# Altium schematic sheet Accelerometer.SchDoc
size A4
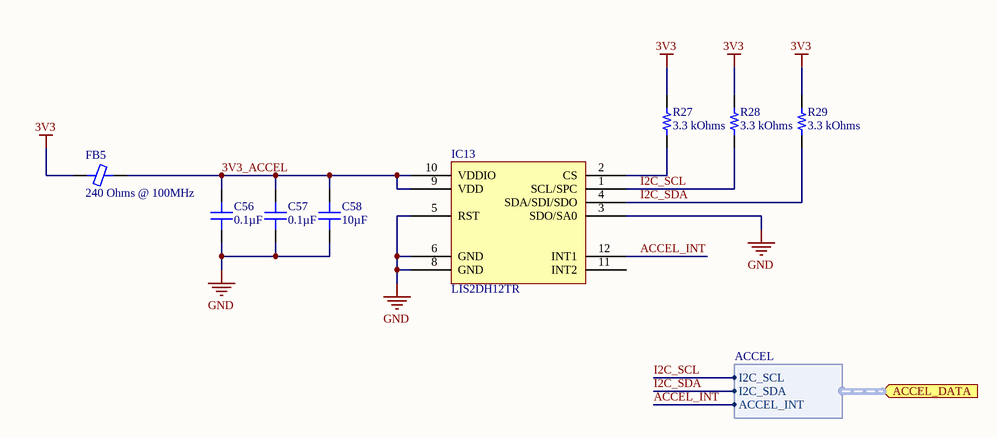
[diagram p0: Accelerometer.SchDoc]

## Parts
C56  0.1µF  [CAP 0201_0603]
C57  0.1µF  [CAP 0201_0603]
C58  10µF  [CAP 0603_1608]
FB5  240 Ohms @ 100MHz  [FER 0201_0603]
IC13  LIS2DH12TR  [ST LGA-12 2x2MM]
R27  3.3 kOhms  [RES 0201_0603]
R28  3.3 kOhms  [RES 0201_0603]
R29  3.3 kOhms  [RES 0201_0603]

## Ports
ACCEL_DATA (in, harness ACCEL)

## Harnesses
ACCEL: I2C_SCL, I2C_SDA, ACCEL_INT

## Nets
3V3: FB5.1 R27.2 R28.2 R29.2
GND: C56.1 C57.1 C58.1 IC13.3(SDO/SA0) IC13.5(RST) IC13.6(GND) IC13.8(GND)
3V3_ACCEL: C56.2 C57.2 C58.2 FB5.2 IC13.9(VDD) IC13.10(VDDIO)
ACCEL_INT: IC13.12(INT1) ; port ACCEL_DATA.ACCEL_INT
I2C_SCL: IC13.1(SCL/SPC) R28.1 ; port ACCEL_DATA.I2C_SCL
I2C_SDA: IC13.4(SDA/SDI/SDO) R29.1 ; port ACCEL_DATA.I2C_SDA
NetIC13_2: IC13.2(CS) R27.1

Not connected (* = marked no-connect by the designer): IC13 11(INT2)

## Notes on the sheet
- Title
- Size:
- Date:
- A4
- Number:
- Time:
- Revision:
- Sheet
- of
- File:

## Library data of the parts
C56 C57 = GRM033R61C104ME84D: CAP CER 0.1UF 16V X5R 0201; Manufacturer: Murata Electronics; Tolerance: ±20%; Part Number: GRM033R61C104ME84D; Value: 0.1µF; Applications: General Purpose; Capacitance: 0.1µF; ComponentLink1Description: Datasheet; ComponentLink1URL: https://search.murata.co.jp/Ceramy/image/img/A01X/G101/ENG/GRM033R61C104ME84-01.pdf; ComponentLink2Description: DigiKey Link; ComponentLink2URL: http://digikey.com/product-detail/en/murata-electronics/GRM033R61C104ME84D/490-9986-1-ND/5026291; Device Package: 0201 (0603 Metric); LastUpdated: 21/01/2020 00:00:12; Lifecycle Status: Active; Minimum Order: 1; Mounting Type: Surface Mount, MLCC; Operating Temperature: -55°C ~ 85°C; Package / Case: 0201 (0603 Metric); Packaging: TapeAndReel; PartId: 1522; Part Status: Active; Price: 0.01; Series: GRM; Size / Dimension: 0.024" L x 0.012" W (0.60mm x 0.30mm); Supplier 1: DigiKey; Supplier Part Number 1: 490-9986-1-ND; Temperature Coefficient: X5R; Thickness (Max): 0.013" (0.33mm); Voltage - Rated: 16V
C58 = LMK107BBJ106KALT: CAP CER 10UF 10V X5R 0603; Manufacturer: Taiyo Yuden; Tolerance: ±10%; Part Number: LMK107BBJ106KALT; Value: 10µF; Applications: SMPS Filtering; Capacitance: 10µF; ComponentLink1Description: Datasheet; ComponentLink1URL: https://ds.yuden.co.jp/TYCOMPAS/ut/detail?pn=LMK107BBJ106KALT &u=M; ComponentLink2Description: DigiKey Link; ComponentLink2URL: http://digikey.com/product-detail/en/taiyo-yuden/LMK107BBJ106KALT/587-6017-1-ND/8040680; Device Package: 0603 (1608 Metric); LastUpdated: 21/01/2020 00:01:56; Lifecycle Status: Active; Minimum Order: 1; Mounting Type: Surface Mount, MLCC; Operating Temperature: -55°C ~ 85°C; Package / Case: 0603 (1608 Metric); Packaging: TapeAndReel; PartId: 10454; Part Status: Active; Price: 0.03; Series: M; Size / Dimension: 0.063" L x 0.031" W (1.60mm x 0.80mm); Supplier 1: DigiKey; Supplier Part Number 1: 587-6017-1-ND; Temperature Coefficient: X5R; Thickness (Max): 0.039" (1.00mm); Voltage - Rated: 10V
FB5 = BK0603TS241-T: FERRITE BEAD 240 OHM 0201 1LN; Manufacturer: Taiyo Yuden; Current Rating (Max): 400mA; DC Resistance (DCR) (Max): 320mOhm; Number of Lines: 1; Part Number: BK0603TS241-T; ComponentLink1Description: Datasheet; ComponentLink1URL: https://ds.yuden.co.jp/TYCOMPAS/ut/detail?pn=BK0603TS241-T  &u=M; ComponentLink2Description: DigiKey Link; ComponentLink2URL: http://digikey.com/product-detail/en/taiyo-yuden/BK0603TS241-T/587-3276-1-ND/4157923; Device Package: 0201 (0603 Metric); Height (Max): 0.013" (0.33mm); Impedance @ Frequency: 240 Ohms @ 100MHz; LastUpdated: 21/01/2020 02:24:59; Lifecycle Status: Active; Minimum Order: 1; Mounting Type: Surface Mount; Operating Temperature: -55°C ~ 125°C; Package / Case: 0201 (0603 Metric); Packaging: TapeAndReel; PartId: 40; Part Status: Active; Price: 0.03; Series: BK; Size / Dimension: 0.024" L x 0.012" W (0.60mm x 0.30mm); Supplier 1: DigiKey; Supplier Part Number 1: 587-3276-1-ND; Value: 240 Ohms @ 100MHz
IC13 = LIS2DH12TR: ACCEL 2-16G I2C/SPI 12LGA; Manufacturer: STMicroelectronics; Acceleration Range: ±2g, 4g, 8g, 16g; Axis: X, Y, Z; Bandwidth: 0.5Hz ~ 672Hz; Output Type: I²C, SPI; Sensitivity (LSB/g): 1000 (±2g) ~ 83 (±16g); Voltage - Supply: 1.71V ~ 3.6V; Part Number: LIS2DH12TR; ComponentLink1Description: Datasheet; ComponentLink1URL: http://www.st.com/content/ccc/resource/technical/document/datasheet/12/c0/5c/36/b9/58/46/f2/DM00091513.pdf/files/DM00091513.pdf/jcr:content/translations/en.DM00091513.pdf; ComponentLink2Description: DigiKey Link; ComponentLink2URL: http://digikey.com/product-detail/en/stmicroelectronics/LIS2DH12TR/497-14851-1-ND/4899838; Device Package: 12-VFLGA; Features: Adjustable Bandwidth, Selectable Scale, Sleep Mode, Temperature Sensor; LastUpdated: 30/03/2020 15:41:11; Lifecycle Status: Active; Minimum Order: 1; Mounting Type: Surface Mount; Operating Temperature: -40°C ~ 85°C (TA); Package / Case: 12-VFLGA; Packaging: TapeAndReel; Part Status: Active; Price: 0.60; Series: -; Supplier 1: DigiKey; Supplier Part Number 1: 497-14851-1-ND; Supplier Device Package: 12-LGA (2x2); Type: Digital
R27-R29 = ERJ-1GNF3301C: RES SMD 3.3K OHM 1% 1/20W 0201; Manufacturer: Panasonic Electronic Components; Power (Watts): 0.05W, 1/20W; Temperature Coefficient: ±200ppm/°C; Part Number: ERJ-1GNF3301C; Value: 3.3 kOhms; ComponentLink1Description: Datasheet; ComponentLink1URL: https://industrial.panasonic.com/cdbs/www-data/pdf/RDA0000/AOA0000C304.pdf; ComponentLink2Description: DigiKey Link; ComponentLink2URL: http://digikey.com/product-detail/en/panasonic-electronic-components/ERJ-1GNF3301C/P122937CT-ND/8342813; Composition: Thick Film; Device Package: 0201 (0603 Metric); Features: Automotive AEC-Q200; Height - Seated (Max): 0.010" (0.26mm); LastUpdated: 21/01/2020 00:04:10; Lifecycle Status: Active; Minimum Order: 1; Number of Terminations: 2; Operating Temperature: -55°C ~ 125°C; Package / Case: 0201 (0603 Metric); Packaging: TapeAndReel; PartId: 4142; Part Status: Active; Price: 0.01; Ratings: AEC-Q200; Resistance: 3.3 kOhms; Series: ERJ; Size / Dimension: 0.024" L x 0.012" W (0.60mm x 0.30mm); Supplier 1: DigiKey; Supplier Part Number 1: P122937CT-ND; Supplier Device Package: 0201; Tolerance: ±1%